# Altium project McuPro.PrjPcb
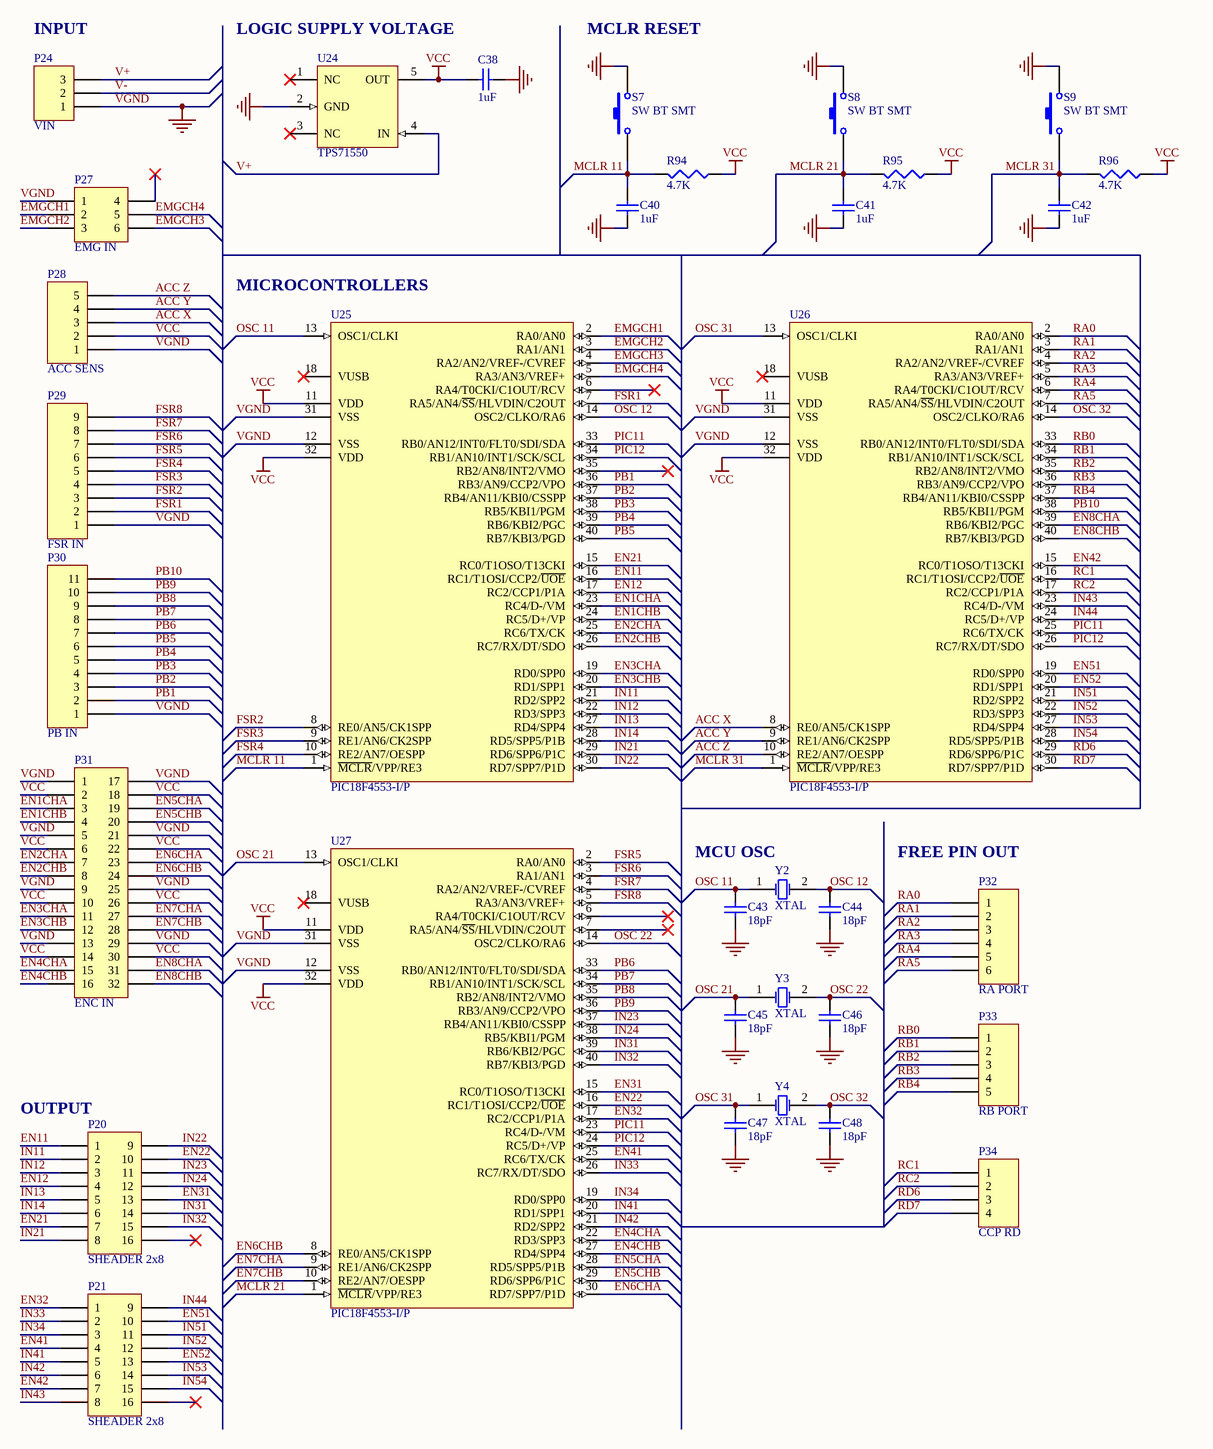
[diagram p0: McuPro.SchDoc]
1 sheet, 34 parts. Net scope: global (net labels, ports and power ports of the same name join across sheets).
Board file: McuProFinal.PcbDoc

## Sheet McuPro.SchDoc
size A3

### Parts
C38  value 1uF  [CAPC2012M]  (hidden comment: Cap Semi)
C40  value 1uF  [CAPC2012M]  (hidden comment: Cap Semi)
C41  value 1uF  [CAPC2012M]  (hidden comment: Cap Semi)
C42  value 1uF  [CAPC2012M]  (hidden comment: Cap Semi)
C43  value 18pF  [C1206]  (hidden comment: Cap Semi)
C44  value 18pF  [C1206]  (hidden comment: Cap Semi)
C45  value 18pF  [C1206]  (hidden comment: Cap Semi)
C46  value 18pF  [C1206]  (hidden comment: Cap Semi)
C47  value 18pF  [C1206]  (hidden comment: Cap Semi)
C48  value 18pF  [C1206]  (hidden comment: Cap Semi)
P20  SHEADER 2x8  [SHBH 2X8]
P21  SHEADER 2x8  [SHBH 2X8]
P24  VIN  [AZUL5-3]
P27  EMG IN  [SHBH 2x3]
P28  ACC SENS  [HDR1X5H]
P29  FSR IN  [HDR1X9H]
P30  PB IN  [HDR1X11H]
P31  ENC IN  [HDR2X16_CEN]
P32  RA PORT  [HDR1X6]
P33  RB PORT  [HDR1X5]
P34  CCP RD  [HDR1X4]
R94  value 4.7K  [RESC3225M]  (hidden comment: Res3)
R95  value 4.7K  [RESC3225M]  (hidden comment: Res3)
R96  value 4.7K  [RESC3225M]  (hidden comment: Res3)
S7  SW BT SMT  [PBOTTON SMT4]
S8  SW BT SMT  [PBOTTON SMT4]
S9  SW BT SMT  [PBOTTON SMT4]
U24  TPS71550  [SOT353-5L]
U25  PIC18F4553-I/P  [PDIP600-P40]
U26  PIC18F4553-I/P  [PDIP600-P40]
U27  PIC18F4553-I/P  [PDIP600-P40]
Y2  XTAL  [XTAL-1]
Y3  XTAL  [XTAL-1]
Y4  XTAL  [XTAL-1]

### Nets
VCC: C38.1 P28.2 P31.2 P31.6 P31.10 P31.14 P31.18 P31.22 P31.26 P31.30 R94.1 R95.1 R96.1 U24.5(OUT) U25.11(VDD) U25.32(VDD) U26.11(VDD) U26.32(VDD) U27.11(VDD) U27.32(VDD)
VGND: C38.2 C40.2 C41.2 C42.2 C43.2 C44.2 C45.2 C46.2 C47.2 C48.2 P24.1 P27.1 P28.1 P29.1 P30.1 P31.1 P31.5 P31.9 P31.13 P31.17 P31.21 P31.25 P31.29 S7.2 S8.2 S9.2 U24.2(GND) U25.12(VSS) U25.31(VSS) U26.12(VSS) U26.31(VSS) U27.12(VSS) U27.31(VSS)  [also labelled GND]
ACC X: P28.3 U26.8(RE0/AN5/CK1SPP)
ACC Y: P28.4 U26.9(RE1/AN6/CK2SPP)
ACC Z: P28.5 U26.10(RE2/AN7/OESPP)
EMGCH1: P27.2 U25.2(RA0/AN0)
EMGCH2: P27.3 U25.3(RA1/AN1)
EMGCH3: P27.6 U25.4(RA2/AN2/VREF-/CVREF)
EMGCH4: P27.5 U25.5(RA3/AN3/VREF+)
EN1CHA: P31.3 U25.23(RC4/D-/VM)
EN1CHB: P31.4 U25.24(RC5/D+/VP)
EN2CHA: P31.7 U25.25(RC6/TX/CK)
EN2CHB: P31.8 U25.26(RC7/RX/DT/SDO)
EN3CHA: P31.11 U25.19(RD0/SPP0)
EN3CHB: P31.12 U25.20(RD1/SPP1)
EN4CHA: P31.15 U27.22(RD3/SPP3)
EN4CHB: P31.16 U27.27(RD4/SPP4)
EN5CHA: P31.19 U27.28(RD5/SPP5/P1B)
EN5CHB: P31.20 U27.29(RD6/SPP6/P1C)
EN6CHA: P31.23 U27.30(RD7/SPP7/P1D)
EN6CHB: P31.24 U27.8(RE0/AN5/CK1SPP)
EN7CHA: P31.27 U27.9(RE1/AN6/CK2SPP)
EN7CHB: P31.28 U27.10(RE2/AN7/OESPP)
EN8CHA: P31.31 U26.39(RB6/KBI2/PGC)
EN8CHB: P31.32 U26.40(RB7/KBI3/PGD)
EN11: P20.1 U25.16(RC1/T1OSI/CCP2/~{UOE})
EN12: P20.4 U25.17(RC2/CCP1/P1A)
EN21: P20.7 U25.15(RC0/T1OSO/T13CKI)
EN22: P20.10 U27.16(RC1/T1OSI/CCP2/~{UOE})
EN31: P20.13 U27.15(RC0/T1OSO/T13CKI)
EN32: P21.1 U27.17(RC2/CCP1/P1A)
EN41: P21.4 U27.25(RC6/TX/CK)
EN42: P21.7 U26.15(RC0/T1OSO/T13CKI)
EN51: P21.10 U26.19(RD0/SPP0)
EN52: P21.13 U26.20(RD1/SPP1)
FSR1: P29.2 U25.7(RA5/AN4/~{SS}/HLVDIN/C2OUT)
FSR2: P29.3 U25.8(RE0/AN5/CK1SPP)
FSR3: P29.4 U25.9(RE1/AN6/CK2SPP)
FSR4: P29.5 U25.10(RE2/AN7/OESPP)
FSR5: P29.6 U27.2(RA0/AN0)
FSR6: P29.7 U27.3(RA1/AN1)
FSR7: P29.8 U27.4(RA2/AN2/VREF-/CVREF)
FSR8: P29.9 U27.5(RA3/AN3/VREF+)
IN11: P20.2 U25.21(RD2/SPP2)
IN12: P20.3 U25.22(RD3/SPP3)
IN13: P20.5 U25.27(RD4/SPP4)
IN14: P20.6 U25.28(RD5/SPP5/P1B)
IN21: P20.8 U25.29(RD6/SPP6/P1C)
IN22: P20.9 U25.30(RD7/SPP7/P1D)
IN23: P20.11 U27.37(RB4/AN11/KBI0/CSSPP)
IN24: P20.12 U27.38(RB5/KBI1/PGM)
IN31: P20.14 U27.39(RB6/KBI2/PGC)
IN32: P20.15 U27.40(RB7/KBI3/PGD)
IN33: P21.2 U27.26(RC7/RX/DT/SDO)
IN34: P21.3 U27.19(RD0/SPP0)
IN41: P21.5 U27.20(RD1/SPP1)
IN42: P21.6 U27.21(RD2/SPP2)
IN43: P21.8 U26.23(RC4/D-/VM)
IN44: P21.9 U26.24(RC5/D+/VP)
IN51: P21.11 U26.21(RD2/SPP2)
IN52: P21.12 U26.22(RD3/SPP3)
IN53: P21.14 U26.27(RD4/SPP4)
IN54: P21.15 U26.28(RD5/SPP5/P1B)
MCLR 11: C40.1 R94.2 S7.1 U25.1(~{MCLR}/VPP/RE3)
MCLR 21: C41.1 R95.2 S8.1 U27.1(~{MCLR}/VPP/RE3)
MCLR 31: C42.1 R96.2 S9.1 U26.1(~{MCLR}/VPP/RE3)
OSC 11: C43.1 U25.13(OSC1/CLKI) Y2.1(OSC1)
OSC 12: C44.1 U25.14(OSC2/CLKO/RA6) Y2.2(OSC2)
OSC 21: C45.1 U27.13(OSC1/CLKI) Y3.1(OSC1)
OSC 22: C46.1 U27.14(OSC2/CLKO/RA6) Y3.2(OSC2)
OSC 31: C47.1 U26.13(OSC1/CLKI) Y4.1(OSC1)
OSC 32: C48.1 U26.14(OSC2/CLKO/RA6) Y4.2(OSC2)
PB1: P30.2 U25.36(RB3/AN9/CCP2/VPO)
PB2: P30.3 U25.37(RB4/AN11/KBI0/CSSPP)
PB3: P30.4 U25.38(RB5/KBI1/PGM)
PB4: P30.5 U25.39(RB6/KBI2/PGC)
PB5: P30.6 U25.40(RB7/KBI3/PGD)
PB6: P30.7 U27.33(RB0/AN12/INT0/FLT0/SDI/SDA)
PB7: P30.8 U27.34(RB1/AN10/INT1/SCK/SCL)
PB8: P30.9 U27.35(RB2/AN8/INT2/VMO)
PB9: P30.10 U27.36(RB3/AN9/CCP2/VPO)
PB10: P30.11 U26.38(RB5/KBI1/PGM)
PIC11: U25.33(RB0/AN12/INT0/FLT0/SDI/SDA) U26.25(RC6/TX/CK) U27.23(RC4/D-/VM)
PIC12: U25.34(RB1/AN10/INT1/SCK/SCL) U26.26(RC7/RX/DT/SDO) U27.24(RC5/D+/VP)
RA0: P32.1 U26.2(RA0/AN0)
RA1: P32.2 U26.3(RA1/AN1)
RA2: P32.3 U26.4(RA2/AN2/VREF-/CVREF)
RA3: P32.4 U26.5(RA3/AN3/VREF+)
RA4: P32.5 U26.6(RA4/T0CKI/C1OUT/RCV)
RA5: P32.6 U26.7(RA5/AN4/~{SS}/HLVDIN/C2OUT)
RB0: P33.1 U26.33(RB0/AN12/INT0/FLT0/SDI/SDA)
RB1: P33.2 U26.34(RB1/AN10/INT1/SCK/SCL)
RB2: P33.3 U26.35(RB2/AN8/INT2/VMO)
RB3: P33.4 U26.36(RB3/AN9/CCP2/VPO)
RB4: P33.5 U26.37(RB4/AN11/KBI0/CSSPP)
RC1: P34.1 U26.16(RC1/T1OSI/CCP2/~{UOE})
RC2: P34.2 U26.17(RC2/CCP1/P1A)
RD6: P34.3 U26.29(RD6/SPP6/P1C)
RD7: P34.4 U26.30(RD7/SPP7/P1D)
V+: P24.3 U24.4(IN)
V-: P24.2

Not connected (* = marked no-connect by the designer): P20 16*; P21 16*; P27 4*; U24 1(NC)* 3(NC)*; U25 6(RA4/T0CKI/C1OUT/RCV)* 18(VUSB)* 35(RB2/AN8/INT2/VMO)*; U26 18(VUSB)*; U27 6(RA4/T0CKI/C1OUT/RCV)* 7(RA5/AN4/~{SS}/HLVDIN/C2OUT)* 18(VUSB)*

### Notes on the sheet
- (near P24) INPUT
- (near U24) LOGIC SUPPLY VOLTAGE
- MCLR RESET
- (near U25) MICROCONTROLLERS
- MCU OSC
- (near P32) FREE PIN OUT
- (near P20) OUTPUT

### Library data of the parts
C38 C40-C48 = Cap Semi: Capacitor (Semiconductor SIM Model); Published: 8-Jun-2000; LatestRevisionDate: 29-May-2009; LatestRevisionNote: IPC-7351 Footprint Added.; PackageReference: C1206; Publisher: Altium Limited; PackageDescription: Chip Capacitor
P20 P21 = SB Header 2x8: Shrouded Box Header: 2x8-Pin, 0.100" (2.54 mm) Male
P24 = Header 3: Header, 3-Pin; LatestRevisionDate: 17-Jul-2002; LatestRevisionNote: Re-released for DXP Platform.; Publisher: Altium Limited
P27 = SB Header 2x3: Shrouded Box Header: 2x8-Pin, 0.100" (2.54 mm) Male
P28 = Header 5H: Header, 5-Pin, Right Angle; LatestRevisionDate: 17-Jul-2002; LatestRevisionNote: Re-released for DXP Platform.; Publisher: Altium Limited
P29 = Header 9H: Header, 9-Pin, Right Angle; LatestRevisionDate: 17-Jul-2002; LatestRevisionNote: Re-released for DXP Platform.; Publisher: Altium Limited
P30 = Header 11H: Header, 11-Pin, Right Angle; LatestRevisionDate: 17-Jul-2002; LatestRevisionNote: Re-released for DXP Platform.; Publisher: Altium Limited
P31 = Header 16X2A: Header, 16-Pin, Dual row; LatestRevisionDate: 17-Jul-2002; LatestRevisionNote: Re-released for DXP Platform.; Publisher: Altium Limited
P32 = Header 6: Header, 6-Pin; LatestRevisionDate: 17-Jul-2002; LatestRevisionNote: Re-released for DXP Platform.; Publisher: Altium Limited
P33 = Header 5: Header, 5-Pin; LatestRevisionDate: 17-Jul-2002; LatestRevisionNote: Re-released for DXP Platform.; Publisher: Altium Limited
P34 = Header 4: Header, 4-Pin; LatestRevisionDate: 17-Jul-2002; LatestRevisionNote: Re-released for DXP Platform.; Publisher: Altium Limited
R94-R96 = Res3: Resistor; Published: 8-Jun-2000; LatestRevisionDate: 29-May-2009; LatestRevisionNote: IPC-7351 Footprint Added.; PackageReference: J1-0603; Publisher: Altium Limited; PackageDescription: Chip Resistor
S7-S9 = SW PB 6mm: Pushbutton Switches FSM2JSMAASTR=6MM TACT SWITCH,
U25-U27 = PIC18F4553-I/P: High Performance, Enhanced Flash, USB Microcontroller with 12-Bit A/D and nanoWatt Technology, 32K Flash, 40-Pin PDIP, Industrial Temperature Range; Published: 29-Jan-2009; DatasheetVersion: revB, Jul-2007; PackageVersion: revAW, Oct-2008; PackageReference: PDIP600-P40; Publisher: Altium Limited; PackageDescription: 40-Lead Plastic Dual In-Line (P) - 600 mil Body [PDIP]; ComponentLink1Description: Manufacturer Link; ComponentLink1URL: http://www.microchip.com; ComponentLink2Description: Datasheet; ComponentLink2URL: http://ww1.microchip.com/downloads/en/DeviceDoc/39887b.pdf; ComponentLink3Description: Packaging Specification; ComponentLink3URL: http://ww1.microchip.com/downloads/en/PackagingSpec/00049AW.pdf
Y2-Y4 = XTAL: Crystal Oscillator; Published: 8-Jun-2000; LatestRevisionDate: 17-Jul-2002; LatestRevisionNote: Re-released for DXP Platform.; PackageReference: R38; Publisher: Altium Limited; PackageDescription: Crystal, Thru-Hole; 2 Leads; Body 3.1 x 8.2 mm (Dia.xH)